# EAGLE design PCU (EAGLE 6.6.0)

## Sheet 1 of 3: Power Mesurment System
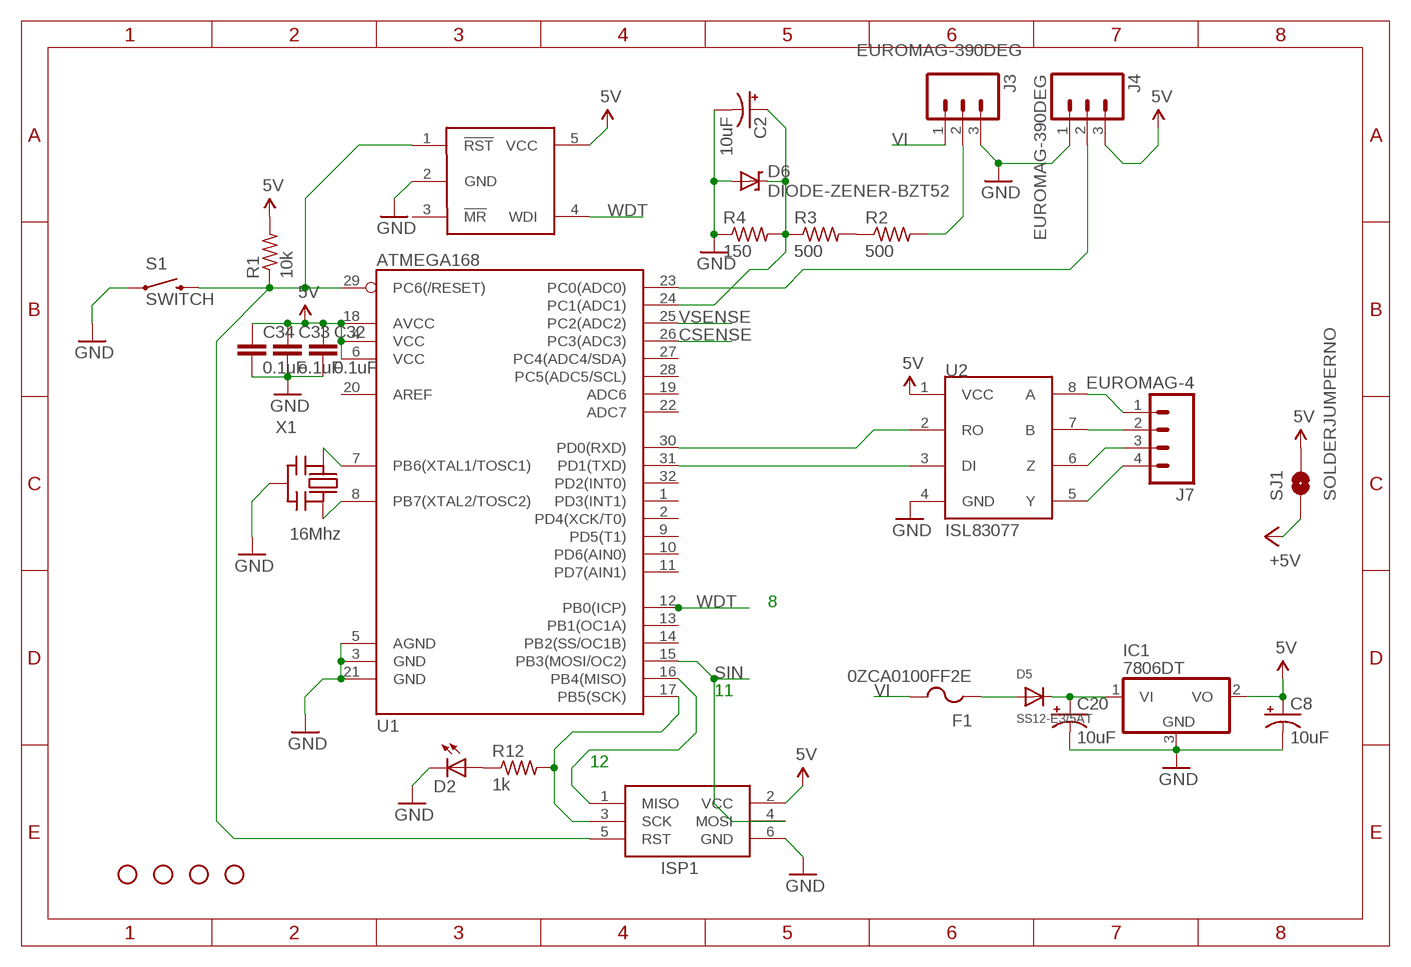
[diagram p0: schematic, sheet 1]

### Parts
C2  10uF  CAP_POL1206  [EIA3216]
C8  10uF  CPOL-USCT6032  [CT6032]
C20  10uF  CPOL-USCT6032  [CT6032]
C32  0.1uF  CAP0805  [0805]
C33  o.1uF  CAP0805  [0805]
C34  0.1uF  CAP0805  [0805]
D2  LEDCHIPLED_0805  [CHIPLED_0805]
D5  SS12-E3/5AT  DIODESMA  [SMADIODE]
D6  DIODE-ZENER-BZT52  [SOD-323]
F1  0ZCA0100FF2E  PTCFUSE-1206  [R1206]
IC1  7806DT  [TO252]
ISP1  AVRISP-6  [AVRISP]
J3  EUROMAG-390DEG  [M3]
J4  EUROMAG-390DEG  [M3]
J7  EUROMAG-4  [M4]
JP1  STAND-OFF  [STAND-OFF]
JP3  STAND-OFF  [STAND-OFF]
JP4  STAND-OFF  [STAND-OFF]
JP5  STAND-OFF  [STAND-OFF]
R1  10k  R-US_M0805  [M0805]
R2  500  R-US_M0805  [M0805]
R3  500  R-US_M0805  [M0805]
R4  150  R-US_M0805  [M0805]
R12  1k  R-US_M0805  [M0805]
S1  SWITCH  SWITCH-MOMENTARY-2PTH  [TACTILE-PTH]
SJ1  SOLDERJUMPERNO  [SJ_2S-NO]
U1  ATMEGA168  [TQFP32-08]
U2  ISL83077  [SO08]
U14  MAX823  [SOT23-5L]
X1  16Mhz  CERMOSCILL-AWCSR  [AWCSR]

### Nets
5V: C8.+ C32.1 C33.1 C34.1 IC1.2(VO) ISP1.2(VCC) J4.3 R1.2 SJ1.2 U1.4(VCC) U1.6(VCC) U1.18(AVCC) U2.1(VCC) U14.5(VCC) ; also sheet 2
+5V: SJ1.1 ; also sheet 2
CSENSE: U1.26(PC3(ADC3)) ; also sheet 2
GND: C2.C(-) C8.- C20.- C32.2 C33.2 C34.2 D2.C D6.2(A) IC1.3(GND) ISP1.6(GND) J3.3 J4.1 R4.1 S1.1 U1.3(GND) U1.5(AGND) U1.21(GND) U2.4(GND) U14.2(GND) X1.2(GND) ; also sheet 2,3
N$1: J7.1 U2.8(A)
N$2: J7.2 U2.7(B)
N$3: J7.3 U2.6(Z)
N$4: ISP1.5(RST) R1.1 S1.3 U1.29(PC6(/RESET)) U14.1(!RST)
N$5: U1.8(PB7(XTAL2/TOSC2)) X1.3(OUT)
N$7: ISP1.1(MISO) U1.16(PB4(MISO))
N$9: U1.7(PB6(XTAL1/TOSC1)) X1.1(IN)
N$11: J7.4 U2.5(Y)
N$12: U1.30(PD0(RXD)) U2.2(RO)
N$18: C20.+ D5.C IC1.1(VI)
N$19: D2.A R12.1
N$21: J3.2 R2.2
N$22: R2.1 R3.2
N$23: C2.A(+) D6.1(C) R3.1 R4.2 U1.24(PC1(ADC1))
N$24: J4.2 U1.23(PC0(ADC0))
N$29: D5.A F1.1
N$32: U1.31(PD1(TXD)) U2.3(DI)
SCLK: ISP1.3(SCK) R12.2 U1.17(PB5(SCK))
SIN: ISP1.4(MOSI) U1.15(PB3(MOSI/OC2))
VI: F1.2 J3.1
VSENSE: U1.25(PC2(ADC2)) ; also sheet 2
WDT: U1.12(PB0(ICP)) U14.4(WDI)
Unconnected: U1.1(PD3(INT1)) U1.2(PD4(XCK/T0)) U1.9(PD5(T1)) U1.10(PD6(AIN0)) U1.11(PD7(AIN1)) U1.13(PB1(OC1A)) U1.14(PB2(SS/OC1B)) U1.19(ADC6) U1.20(AREF) U1.22(ADC7) U1.27(PC4(ADC4/SDA)) U1.28(PC5(ADC5/SCL)) U1.32(PD2(INT0)) U14.3(!MR)

### Notes on the sheet
- 8
- 11
- 12

## Sheet 2 of 3: Power Control System (PCS)
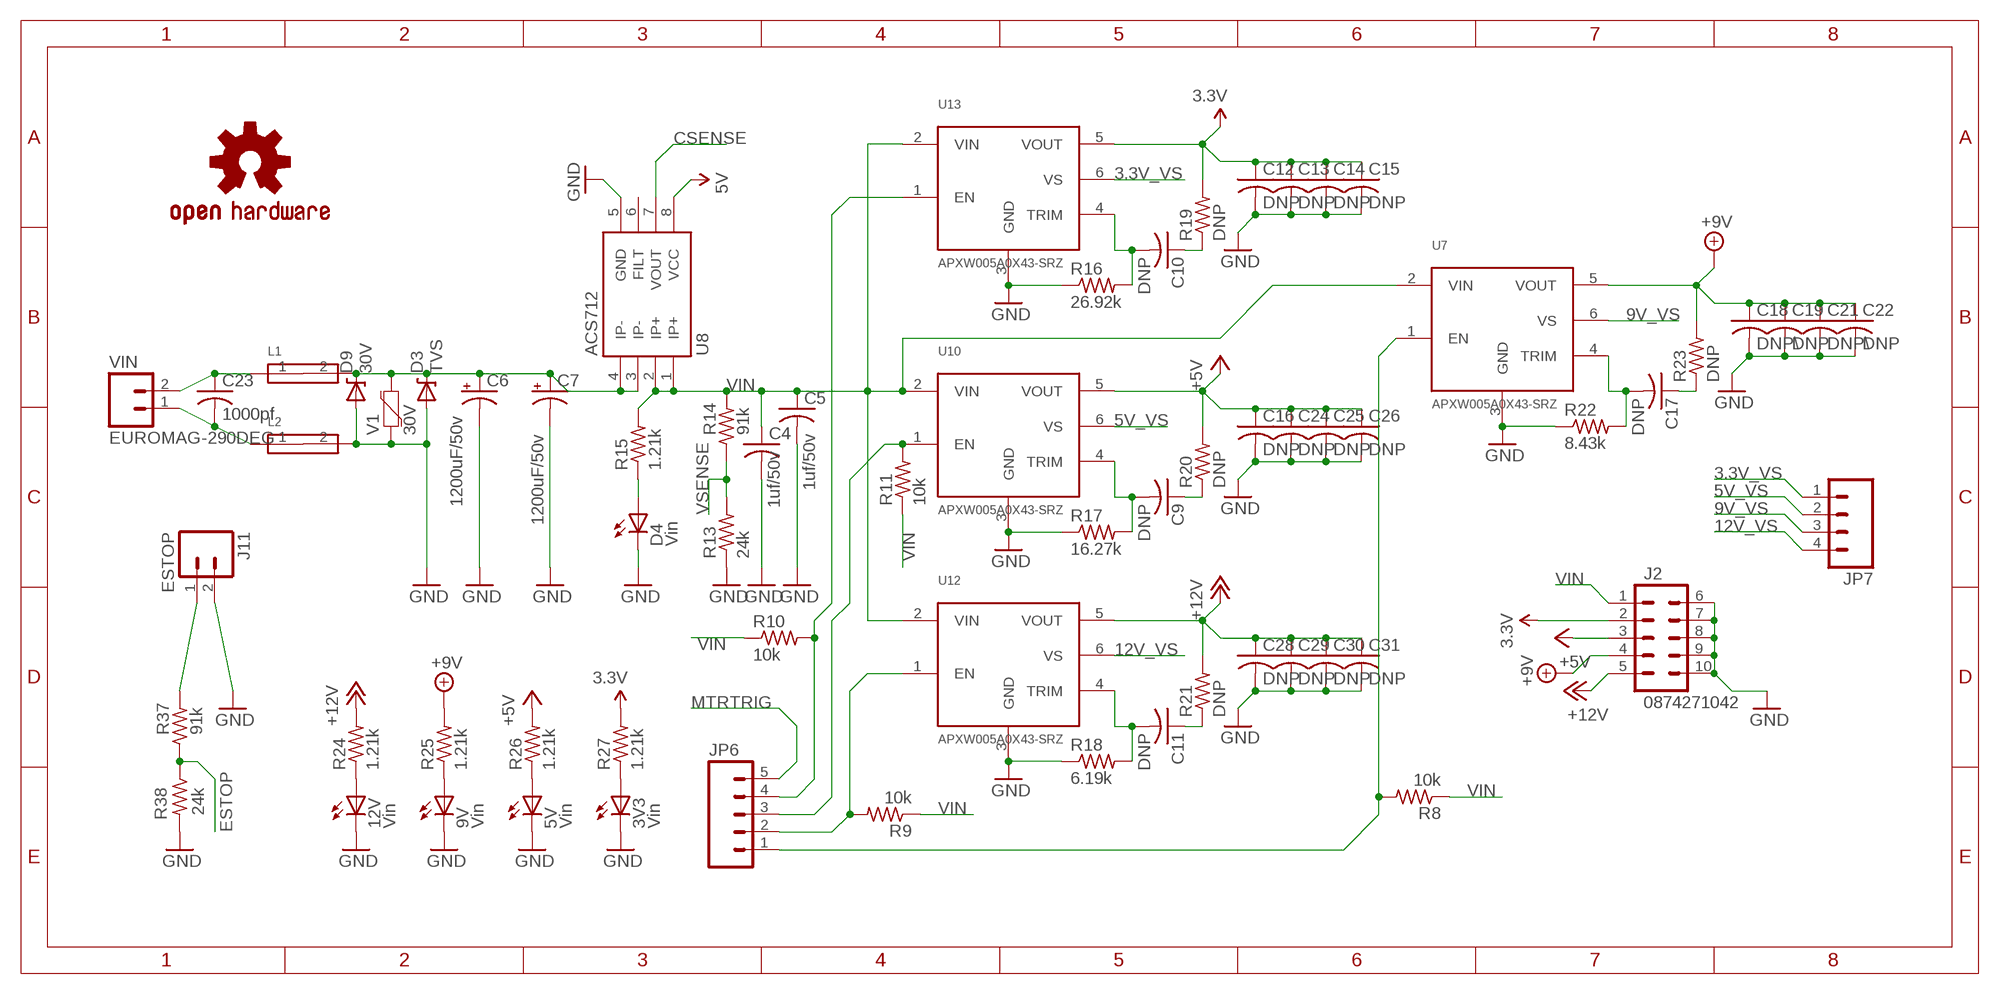
[diagram p1: schematic, sheet 2]

### Parts
3V3  Vin  LEDCHIP-LED0805  [CHIP-LED0805]
5V  Vin  LEDCHIP-LED0805  [CHIP-LED0805]
9V  Vin  LEDCHIP-LED0805  [CHIP-LED0805]
12V  Vin  LEDCHIP-LED0805  [CHIP-LED0805]
C4  1uf/50v  C-USC0805  [C0805]
C5  1uf/50v  C-USC0805  [C0805]
C6  1200uF/50v  CAP_CAN1  [CAN_18MM]
C7  1200uF/50v  CAP_CAN1  [CAN_18MM]
C9  DNP  C-USC0805  [C0805]
C10  DNP  C-USC0805  [C0805]
C11  DNP  C-USC0805  [C0805]
C12  DNP  C-USC0805  [C0805]
C13  DNP  C-USC0805  [C0805]
C14  DNP  C-USC0805  [C0805]
C15  DNP  C-USC0805  [C0805]
C16  DNP  C-USC0805  [C0805]
C17  DNP  C-USC0805  [C0805]
C18  DNP\  C-USC0805  [C0805]
C19  DNP  C-USC0805  [C0805]
C21  DNP\  C-USC0805  [C0805]
C22  DNP  C-USC0805  [C0805]
C23  1000pf  C-USC1825  [C1825]
C24  DNP  C-USC0805  [C0805]
C25  DNP  C-USC0805  [C0805]
C26  DNP  C-USC0805  [C0805]
C28  DNP  C-USC0805  [C0805]
C29  DNP  C-USC0805  [C0805]
C30  DNP  C-USC0805  [C0805]
C31  DNP  C-USC0805  [C0805]
D3  TVS  [DO-214AC]
D4  Vin  LEDCHIP-LED0805  [CHIP-LED0805]
D9  30V  DIODE-ZENERSMB  [SMB-DIODE]
J2  0874271042  [0874271042]
J11  ESTOP  EUROMAG-290DEG  [M2]
JP6  M05PTH_LONGPADS  [1X05_LONGPADS]
JP7  M04POLAR  [MOLEX-1X4]
L1  FERITEBEAD  [0603]
L2  FERITEBEAD  [0603]
R8  10k  R-US_R0805  [R0805]
R9  10k  R-US_R0805  [R0805]
R10  10k  R-US_R0805  [R0805]
R11  10k  R-US_R0805  [R0805]
R13  24k  R-US_R0805  [R0805]
R14  91k  R-US_R0805  [R0805]
R15  1.21k  R-US_R0805  [R0805]
R16  26.92k  R-US_R0805  [R0805]
R17  16.27k  R-US_R0805  [R0805]
R18  6.19k  R-US_R0805  [R0805]
R19  DNP  R-US_R0805  [R0805]
R20  DNP  R-US_R0805  [R0805]
R21  DNP  R-US_R0805  [R0805]
R22  8.43k  R-US_R0805  [R0805]
R23  DNP  R-US_R0805  [R0805]
R24  1.21k  R-US_R0805  [R0805]
R25  1.21k  R-US_R0805  [R0805]
R26  1.21k  R-US_R0805  [R0805]
R27  1.21k  R-US_R0805  [R0805]
R37  91k  R-US_R0805  [R0805]
R38  24k  R-US_R0805  [R0805]
U7  APXW005A0X43-SRZ  [APXW005A0X43-SRZ]
U8  ACS712  [SO08]
U10  APXW005A0X43-SRZ  [APXW005A0X43-SRZ]
U12  APXW005A0X43-SRZ  [APXW005A0X43-SRZ]
U13  APXW005A0X43-SRZ  [APXW005A0X43-SRZ]
U$8  OSHW-LOGOM  [OSHW-LOGO-M]
V1  30V  VARISTOR-0603  [0603-RES]
VIN  EUROMAG-290DEG  [M2]

### Nets
3.3V: C12.1 C13.1 C14.1 C15.1 J2.2 R19.2 R27.2 U13.5(VOUT)
3.3V_VS: JP7.1 U13.6(VS)
5V: U8.8(VCC) ; also sheet 1
5V_VS: JP7.2 U10.6(VS)
9V_VS: JP7.3 U7.6(VS)
12V_VS: JP7.4 U12.6(VS)
+5V: C16.1 C24.1 C25.1 C26.1 J2.3 R20.2 R26.2 U10.5(VOUT) ; also sheet 1
+9V: C18.1 C19.1 C21.1 C22.1 J2.4 R23.2 R25.2 U7.5(VOUT)
+12V: C28.1 C29.1 C30.1 C31.1 J2.5 R21.2 R24.2 U12.5(VOUT)
CSENSE: U8.7(VOUT) ; also sheet 1
ESTOP: R37.1 R38.1
GND: 3V3.C 5V.C 9V.C 12V.C C4.2 C5.2 C6.- C7.- C12.2 C13.2 C14.2 C15.2 C16.2 C18.2 C19.2 C21.2 C22.2 C24.2 C25.2 C26.2 C28.2 C29.2 C30.2 C31.2 D3.A D4.C D9.A J2.6 J2.7 J2.8 J2.9 J2.10 J11.2 L2.2 R13.1 R16.1 R17.1 R18.1 R22.1 R38.2 U7.3(GND) U8.5(GND) U10.3(GND) U12.3(GND) U13.3(GND) V1.1 ; also sheet 1,3
MTRTRIG: JP6.5 ; also sheet 3
N$6: 12V.A R24.1
N$8: 9V.A R25.1
N$10: JP6.4 R10.2 U13.1(EN)
N$13: 5V.A R26.1
N$14: 3V3.A R27.1
N$15: JP6.3 R11.2 U10.1(EN)
N$16: JP6.2 R9.2 U12.1(EN)
N$17: JP6.1 R8.2 U7.1(EN)
N$31: C23.2 L2.1 VIN.1
N$40: J11.1 R37.2
N$41: C6.+ C7.+ D3.C D9.C L1.2 U8.3(IP-) U8.4(IP-) V1.2
N$42: D4.A R15.1
N$43: C9.2 R17.2 U10.4(TRIM)
N$44: C10.2 R16.2 U13.4(TRIM)
N$45: C11.2 R18.2 U12.4(TRIM)
N$46: C10.1 R19.1
N$47: C9.1 R20.1
N$48: C11.1 R21.1
N$49: C17.2 R22.2 U7.4(TRIM)
N$50: C17.1 R23.1
VIN [power]: C4.1 C5.1 J2.1 R8.1 R9.1 R10.1 R11.1 R14.2 R15.2 U7.2(VIN) U8.1(IP+) U8.2(IP+) U10.2(VIN) U12.2(VIN) U13.2(VIN)
VOL: C23.1 L1.1 VIN.2
VSENSE: R13.2 R14.1 ; also sheet 1
Unconnected: U8.6(FILT)

## Sheet 3 of 3: Vibrating motor control
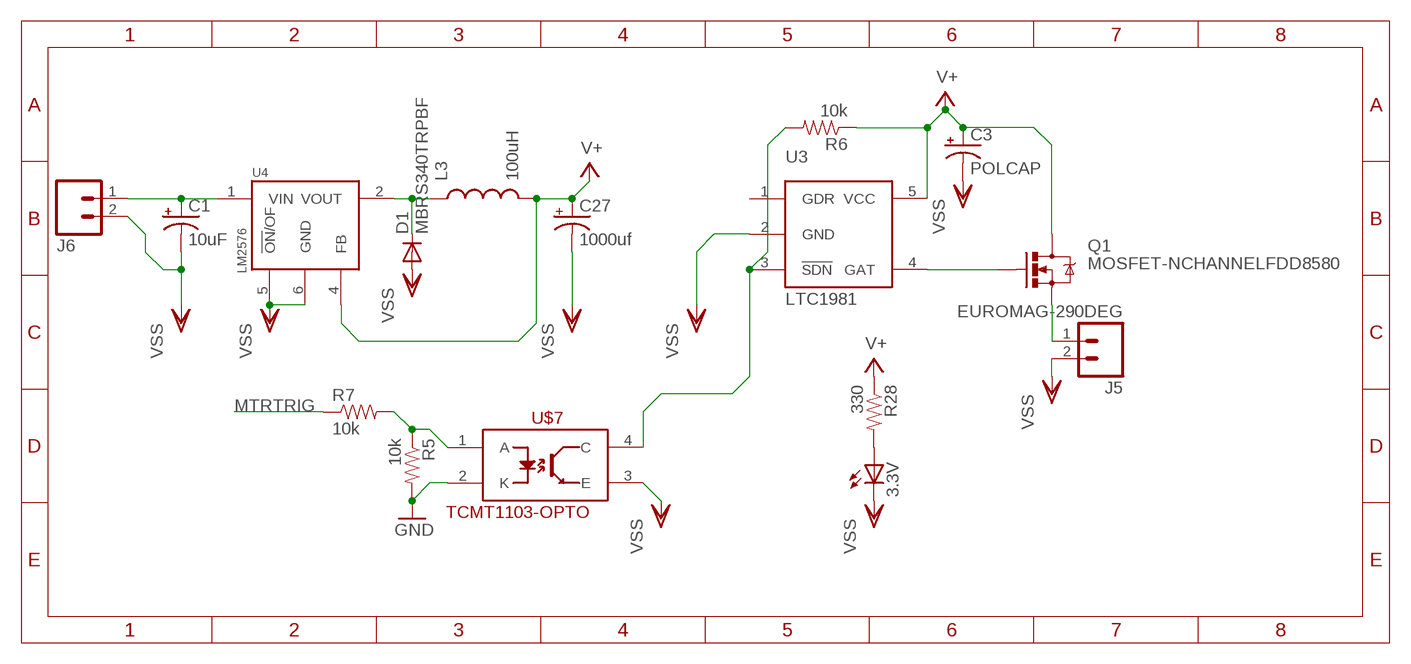
[diagram p2: schematic, sheet 3]

### Parts
3.3V  LEDCHIPLED_0805  [CHIPLED_0805]
C1  10uF  CAP_POL7343  [EIA7343]
C3  POLCAP  [POLC1206]
C27  1000uf  CAP_POLG  [PANASONIC_G]
D1  MBRS340TRPBF  DIODE-SMC  [SMC]
J5  EUROMAG-290DEG  [M2]
J6  EUROMAG-290DEG  [M2]
L3  100uH  INDUCTOR  [INDUCTOR_5X3]
Q1  MOSFET-NCHANNELFDD8580  [DPAK]
R5  10k  RESISTOR0805-RES  [0805]
R6  10k  RESISTOR0805-RES  [0805]
R7  10k  RESISTOR0805-RES  [0805]
R28  330  RESISTOR0805-RES  [0805]
U3  LTC1981  [SOT23-5L]
U4  LM2576  [TO-263-5]
U$7  TCMT1103-OPTO  [SSOP-4]

### Nets
GND: R5.2 U$7.2(K) ; also sheet 1,2
MTRTRIG: R7.1 ; also sheet 2
N$20: D1.C L3.1 U4.2(VOUT)
N$25: Q1.1(G) U3.4(GAT)
N$26: R6.2 U3.3(!SDN) U$7.4(C)
N$27: J5.1 Q1.3(S)
N$28: R5.1 R7.2 U$7.1(A)
N$30: 3.3V.A R28.2
V+: C3.1(+) C27.+ L3.2 Q1.4(D) R6.1 R28.1 U3.5(VCC) U4.4(FB)
VOLTIN: C1.A(+) J6.1 U4.1(VIN)
VSS: 3.3V.C C1.C(-) C3.2(-) C27.- D1.A J5.2 J6.2 U3.2(GND) U4.5(!ON!/OF) U4.6(GND) U$7.3(E)
Unconnected: U3.1(GDR)

## Library data of the parts
3.3V 3V3 5V 9V 12V D2 D4 = adafruit:LED: LED OSRAM: - CHIPLED LG R971, LG N971, LY N971, LG Q971, LY Q971, LO R971, LY R971 LH N974, LH R974 LS Q976, LO Q976, LY Q976 LO Q996 - Hyper CHIPLED LW Q18S LB Q993, LB Q99A, LB R99A - SideLED LS A670, LO A670, LY A670, LG A670, LP A670 LB A673, LV A673, LT A673, LW A673 LH A674 LY A675 LS A676, LA A676, LO A676, LY A676, LW A676 LS A679, LY A679, LG A679 - Hyper Micro SIDELED® LS Y876, LA Y876, LO Y876, LY Y876 LT Y87S - SmartLED LW L88C, LW L88S LB L89C, LB L89S, LG L890 LS L89K, LO L89K, LY L89K LS L896, LA L896, LO L896, LY L896 - TOPLED LS T670, LO T670, LY T670, LG T670, LP T670 LSG T670, LSP T670, LSY T670, LOP T670, LYG T670 LG T671, LOG T671, LSG T671 LB T673, LV T673, LT T673, LW T673 LH T674 LS T676, LA T676, LO T676, LY T676, LB T676, LH T676, LSB T676, LW T676 LB T67C, LV T67C, LT T67C, LS T67K, LO T67K, LY T67K, LW E67C LS E67B, LA E67B, LO E67B, LY E67B, LB E67C, LV E67C, LT E67C LW T67C LS T679, LY T679, LG T679 LS T770, LO T770, LY T770, LG T770, LP T770 LB T773, LV T773, LT T773, LW T773 LH T774 LS E675, LA E675, LY E675, LS T675 LS T776, LA T776, LO T776, LY T776, LB T776 LHGB T686 LT T68C, LB T68C - Hyper Mini TOPLED® LB M676 - Mini TOPLED Santana® LG M470 LS M47K, LO M47K, LY M47K Source: http://www.osram.convergy.de/
C1 C2 C27 = SparkFun:CAP_POL: Capacitor Polarized These are standard SMD and PTH capacitors. Normally 10uF, 47uF, and 100uF in electrolytic and tantalum varieties. Always verify the external diameter of the through hole cap, it varies with capacity, voltage, and manufacturer. The EIA devices should be standard.
C3 = NASA_LIB:POLCAP
C4 C5 C9-C19 C21-C26 C28-C31 = adafruit:C-US: CAPACITOR, American symbol
C6 C7 = NASA_LIB:CAP_CAN
C8 C20 = adafruit:CPOL-US: POLARIZED CAPACITOR, American symbol
C32-C34 = SparkFun:CAP: Capacitor Standard 0603 ceramic capacitor, and 0.1" leaded capacitor.
D1 = diode:DIODE-: DIODE
D3 = NASA_LIB:TVS
D5 = adafruit:DIODE: Diode SMADIODE - SMA Surface Mount Package 20V 1A Schottky Diode Digikey: 641-1014-6-ND DO-1N4148 - Through Hole Small Current Diode SOD-123 20V 1 A (.5mV Vf) Schottky Diode - Digikey: MBRX120TPMSCT-ND SOD-323 10V 570mA (.38mV Vf, 3ns) Schottky Diode - Digikey: ZLLS410CT-ND SOD-523 30V 30mA Schottky Diode (RB751S-40TE61) - Digikey: RB751S-40TE61CT-ND SOT23-R/W - SOT23 Package (R = Solder Paste/Reflow Ovens, W = Hand-Soldering) BAT54Film 40V 300mA - Digikey: 497-7162-1-ND
D6 D9 = SparkFun:DIODE-ZENER: Zener Diode Production Part - 8199 3.4V Zener Voltage
F1 = adafruit:PTCFUSE: PTC fuses, resettable thermistors
IC1 = adafruit:78*: Positive VOLTAGE REGULATOR Added bigger pads to the TO-92 package
ISP1 = adafruit:AVRISP: AVR ISP HEADER Standard 6 pin header for AVR programming
J2 = NASA_LIB:0874271042
J3 J4 = NASA_LIB:EUROMAG-3
J5 J6 J11 VIN = NASA_LIB:EUROMAG-2
J7 = NASA_LIB:EUROMAG-4
JP1 JP3-JP5 = SparkFun:STAND-OFF: Stand Off This is the mechanical footprint for a #4 phillips button head screw. Use the keepout ring to avoid running the screw head into surrounding components. SKU : PRT-00447
JP6 = SparkFun:M05: Header 5 Standard 5-pin 0.1" header. Use with straight break away headers (SKU : PRT-00116), right angle break away headers (PRT-00553), swiss pins (PRT-00743), machine pins (PRT-00117), and female headers (PRT-00115). Molex polarized connector foot print use with SKU : PRT-08230 with associated crimp pins and housings.
JP7 = SparkFun:M04: Header 4 Standard 4-pin 0.1" header. Use with straight break away headers (SKU : PRT-00116), right angle break away headers (PRT-00553), swiss pins (PRT-00743), machine pins (PRT-00117), and female headers (PRT-00115). Molex polarized connector foot print use with SKU : PRT-08231 with associated crimp pins and housings. 1MM SMD Version SKU: PRT-10208
L1 L2 = EmEndev:FERITEBEAD
L3 = NASA_LIB:INDUCTOR
Q1 = SparkFun:MOSFET-NCHANNEL
R1-R4 R8-R27 R37 R38 = adafruit:R-US_: RESISTOR, American symbol
R5-R7 R28 = SparkFun:RESISTOR: Resistor Basic schematic elements and footprints for 0603, 1206, and PTH resistors.
S1 = SparkFun:SWITCH-MOMENTARY-2
SJ1 = SparkFun:SOLDERJUMPER: Solder Jumper Standard SMD solder jumper. Used to automate production. Two varients : Normally Open and Normally Closed are the same, but have different paste layers. NC will have a large amount of paste and should jumper during reflow.
U1 = SparkFun:ATMEGA168
U2 = NASA_LIB:ISL83077
U3 = NASA_LIB:LTC1981
U4 = NASA_LIB:LM2576
U7 U10 U12 U13 = NASA_LIB:APXW005A0X43-SRZ
U8 = SparkFun:ACS712
U14 = NASA_LIB:MAX823
U$7 = SparkFun:TCMT1103-OPTO
U$8 = SparkFun:OSHW-LOGO: Open Source Hardware Logo This logo indicates the piece of hardware it is found on incorporates a OSHW license and/or adheres to the definition of open source hardware found here: http://freedomdefined.org/OSHW
V1 = SparkFun:VARISTOR: Varistor Varistor (Variable resistor) is a nonlinear resistive element of the voltage dependence that resistance changes with applied voltage. Varistor is equivalent with Zener diode of two series connection.
X1 = adafruit:CERMOSCILL: Ceramic oscillator with built in capacitors such as ZTT-12MHz http://www.ladyada.net/library/eagle

## Net classes
1 power: width 0.61 mm, drill 0.711 mm, clearance 0.203 mm

## Board
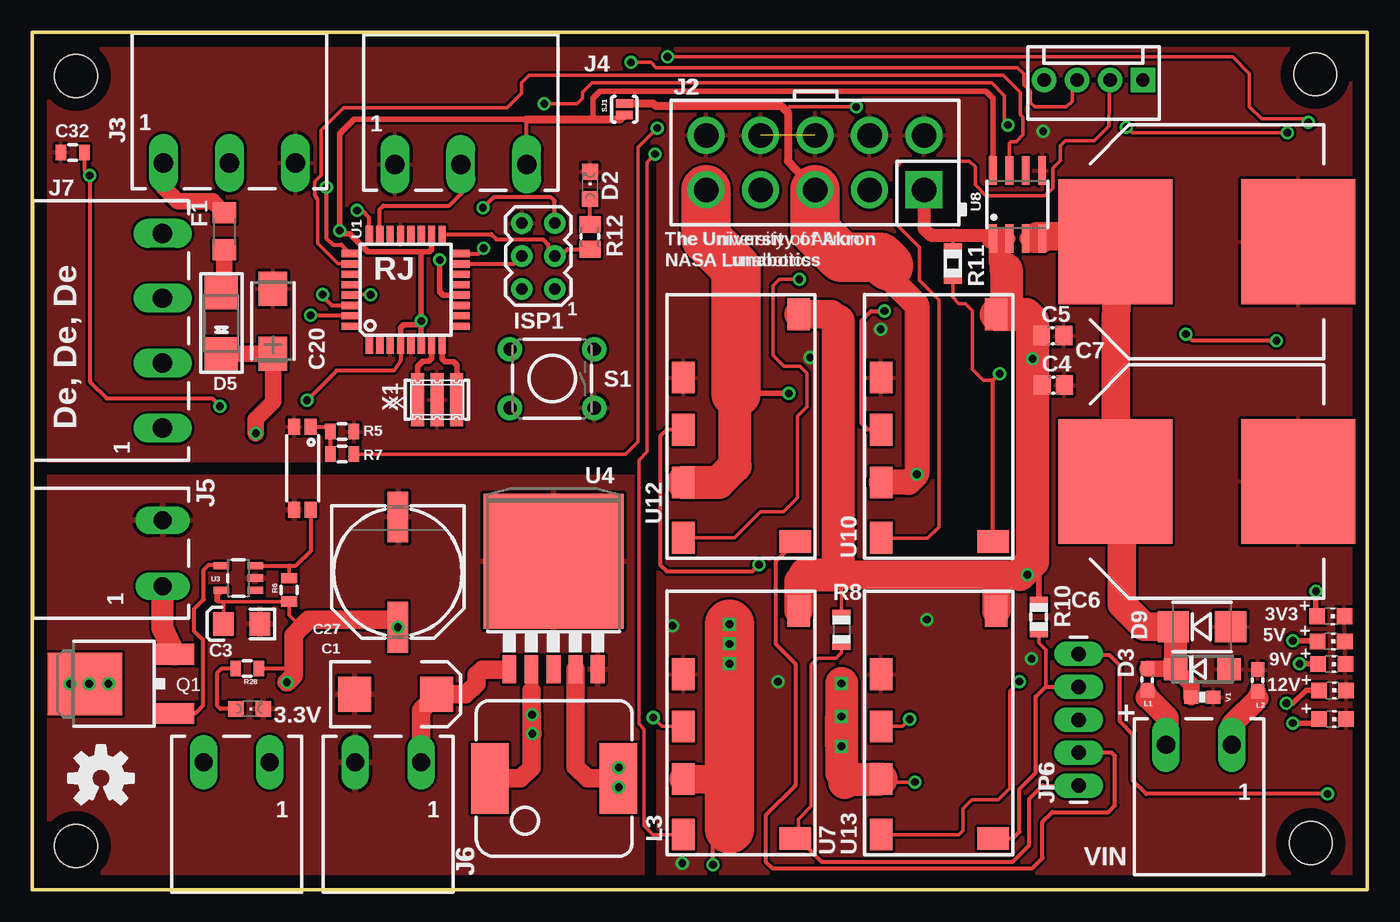
[diagram p3: board, top side]
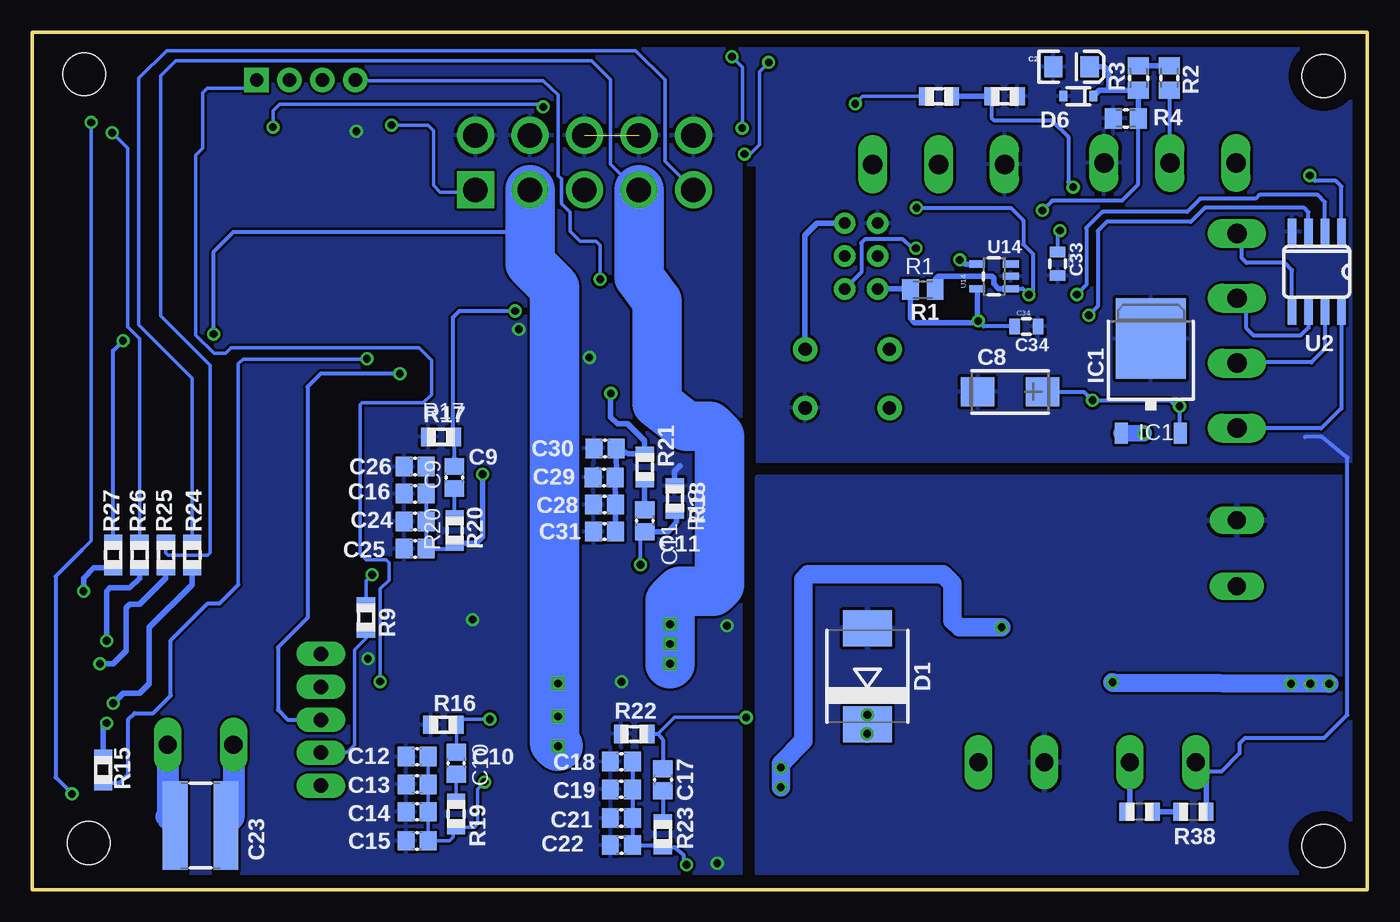
[diagram p4: board, bottom side, seen from below]

Size 102.87 x 66.04 mm. Coordinates in mm from the lower left corner, seen from the top.
Outline: 0,0 102.87,0 102.87,66.04 0,66.04 0,0
Copper layers (1*16): Top 0.035mm / dielectric 1.5mm / Bottom 0.035mm
Design rules "default": minimum track width 10mil, minimum drill 24mil, track to track 8mil, track to pad 8mil, pad to pad 8mil, via to via 8mil, smd to smd 8mil, copper to edge 40mil, drill to drill 8mil, minimum pad ring 10mil, minimum via ring 8mil, stop-mask expansion 4mil, vias tented up to drill 0mil, thermal gap 10mil

### Footprints (pad centres in the part's own frame; a part is rotated, then mirrored left to right if it is on the bottom)
CHIPLED_0805 = smd 1.2 x 1.2: A 0,-1.05; C 0,1.05
CHIP-LED0805 = smd 1.2 x 1.2: A 0,-1.05; C 0,1.05
EIA7343 = smd 2.55 x 2.7: A 3.17,0; C -3.17,0
EIA3216 = smd 1.4 x 1.6: A 1.4,0; C -1.4,0
POLC1206 = smd 1.6 x 1.8: 1 -1.4,0; 2 1.4,0
C0805 = smd 1.3 x 1.5: 1 -0.85,0; 2 0.85,0
CAN_18MM = smd 8.8 x 9.6: + 7.05,0; - -7.05,0
CT6032 = smd 2.6 x 2.2: + 2.5,0; - -2.5,0
C1825 = smd 1.9 x 6.8: 1 -1.95,0; 2 1.95,0
PANASONIC_G = smd 3.9 x 1.6: + 4.25,0; - -4.25,0
0805 = smd 0.8 x 1.2: 1 -0.9,0; 2 0.9,0
SMC = smd 2.8 x 3.8: A 3.7,0; C -3.7,0
DO-214AC = smd 1.8 x 1.7: A 2.05,0; C -2.05,0
SMADIODE = smd 2.54 x 2.54: A 2.349,0; C -2.349,0
SOD-323 = smd 0.63 x 0.83: 1 -1.15,0; 2 1.15,0
SMB-DIODE = smd 2.4 x 2.4: A 2.2,0; C -2.2,0
R1206 = smd 1.6 x 1.803: 1 -1.422,0; 2 1.422,0
TO252 = smd 1 x 1.6: 1 -2.28,-4.8; 2 2.28,-4.8 | smd 5.4 x 6.2: 3 0,2.5
AVRISP = drill 0.9 pad 1.626: 1 -1.27,2.54; 2 1.27,2.54; 3 -1.27,0; 4 1.27,0; 5 -1.27,-2.54; 6 1.27,-2.54
0874271042 = drill 1.9 square: 1 8.4,-2.1 | drill 1.9: 2 4.2,-2.1; 3 0,-2.1; 4 -4.2,-2.1; 5 -8.4,-2.1; 6 8.4,2.1; 7 4.2,2.1; 8 0,2.1; 9 -4.2,2.1; 10 -8.4,2.1
M3 = drill 1.5 long: 1 -5.08,0; 2 0,0; 3 5.08,0
M2 = drill 1.4 long: 1 -2.54,0; 2 2.54,0
M4 = drill 1.5 long: 1 0,0; 2 5,0; 3 10,0; 4 15,0
STAND-OFF = hole 3.302: 0,0
1X05_LONGPADS = drill 1.118 pad 1.88 long: 1 0,0; 2 2.54,0; 3 5.08,0; 4 7.62,0; 5 10.16,0
MOLEX-1X4 = drill 1.016 pad 1.88 square: 1 0,0 | drill 1.016 pad 1.88: 2 2.54,0; 3 5.08,0; 4 7.62,0
0603 = smd 1.1 x 1: 1 -0.85,0; 2 0.85,0
INDUCTOR_5X3 = smd 2.9 x 5.4: 1 -4.95,0; 2 4.95,0
DPAK = smd 1.6 x 3: 1 -2.28,-5.31; 3 2.28,-5.31 | smd 4.826 x 5.715: 4 0,1.588
M0805 = smd 1.3 x 1.6: 1 -0.95,0; 2 0.95,0
R0805 = smd 1.1 x 1.4: 1 -1,0; 2 1,0
TACTILE-PTH = drill 1.016 pad 1.88: 1 -3.251,2.261; 2 3.251,2.261; 3 -3.251,-2.261; 4 3.251,-2.261
SJ_2S-NO = smd 0.635 x 1.27: 1 -0.45,0; 2 0.45,0
TQFP32-08 = smd 1.27 x 0.559: 1 -4.293,2.8; 2 -4.293,2; 3 -4.293,1.2; 4 -4.293,0.4; 5 -4.293,-0.4; 6 -4.293,-1.2; 7 -4.293,-2; 8 -4.293,-2.8; 17 4.293,-2.8; 18 4.293,-2; 19 4.293,-1.2; 20 4.293,-0.4; 21 4.293,0.4; 22 4.293,1.2; 23 4.293,2; 24 4.293,2.8 | smd 0.559 x 1.27: 9 -2.8,-4.293; 10 -2,-4.293; 11 -1.2,-4.293; 12 -0.4,-4.293; 13 0.4,-4.293; 14 1.2,-4.293; 15 2,-4.293; 16 2.8,-4.293; 25 2.8,4.293; 26 2,4.293; 27 1.2,4.293; 28 0.4,4.293; 29 -0.4,4.293; 30 -1.2,4.293; 31 -2,4.293; 32 -2.8,4.293
SO08 = smd 0.66 x 2.032: 1 -1.905,-3.073; 2 -0.635,-3.073; 3 0.635,-3.073; 4 1.905,-3.073; 5 1.905,3.073; 6 0.635,3.073; 7 -0.635,3.073; 8 -1.905,3.073
SOT23-5L = smd 0.55 x 1.2: 1 -0.95,-1.3; 2 0,-1.3; 3 0.95,-1.3; 4 0.95,1.3; 5 -0.95,1.3
TO-263-5 = smd 1.067 x 2.159: 1 -3.404,-7.061; 2 -1.702,-7.061; 3 0,-7.061; 4 1.702,-7.061; 5 3.404,-7.061 | smd 10.8 x 10.41: 6 0,1.27
APXW005A0X43-SRZ = smd 1.73 x 2.44: 1 1.28,1.52 | smd 2.44 x 1.73: 2 18.796,1.27; 3 13.92,10.16; 4 9.906,10.16; 5 5.842,10.16; 6 1.574,10.16
SO08' = smd 0.61 x 2.21: 1 -1.905,-2.616; 2 -0.635,-2.616; 3 0.635,-2.616; 4 1.905,-2.616; 5 1.905,2.616; 6 0.635,2.616; 7 -0.635,2.616; 8 -1.905,2.616
SSOP-4 = smd 1.2 x 0.9: 1 -3.2,0.67; 2 -3.2,-0.6; 3 3.2,-0.6; 4 3.2,0.67
0603-RES = smd 1.1 x 1: 1 -0.85,0; 2 0.85,0
AWCSR = smd 1 x 4.1: 1 -1.5,0; 2 0,0; 3 1.5,0

### Placement (x,y rotation side)
3.3V  16.74,13.92 270 top
3V3  100.08,21.06 270 top
5V  100.1,19.13 270 top
9V  100.15,17.37 270 top
12V  100.2,15.34 270 top
C1  27.99,15.04 0 top
C2  22.78,63.4 0 bottom
C3  16.13,20.47 0 top
C4  78.69,38.86 0 top
C5  78.64,42.67 0 top
C6  90.53,31.45 180 top
C7  90.53,49.91 180 top
C8  27.51,38.35 0 bottom
C9  70.36,31.75 90 bottom
C10  70.21,9.73 90 bottom
C11  55.68,28.42 270 bottom
C12  73.23,10.24 180 bottom
C13  73.23,8.1 180 bottom
C14  73.23,5.99 180 bottom
C15  73.23,3.76 180 bottom
C16  73.38,30.51 180 bottom
C17  54.28,8.46 90 bottom
C18  57.48,9.86 180 bottom
C19  57.48,7.72 180 bottom
C20  18.54,43.79 270 top
C21  57.48,5.51 180 bottom
C22  57.48,3.43 180 bottom
C23  89.92,4.93 180 bottom
C24  73.38,28.37 180 bottom
C25  73.38,26.26 180 bottom
C26  73.38,32.59 180 bottom
C27  28.17,24.46 270 top
C28  58.78,29.67 180 bottom
C29  58.8,31.75 180 bottom
C30  58.72,33.99 180 bottom
C31  58.78,27.58 180 bottom
C32  3.1,56.79 180 top
C33  23.85,48.21 270 bottom
C34  26.26,43.38 0 bottom
D1  38.51,16.43 90 bottom
D2  42.98,54.25 0 top
D3  90.17,16.97 0 top
D4  100.2,13.13 270 top
D5  14.55,43.64 90 top
D6  22.25,61.14 180 bottom
D9  90.14,20.24 0 top
F1  14.78,50.72 90 top
IC1  16.66,39.95 0 bottom
ISP1  38.99,48.81 180 top
J2  60.33,56.01 0 top
J3  15.19,55.98 0 top
J4  33.02,55.88 0 top
J5  10.03,25.91 90 top
J6  27.41,9.8 180 top
J7  10.03,35.56 90 top
J11  15.75,9.8 180 top
JP1  98.88,62.81 0 top
JP3  3.35,3.35 0 top
JP4  3.35,62.69 0 top
JP5  98.53,3.58 0 top
JP6  80.64,8 90 top
JP7  85.6,62.38 180 top
L1  85.93,16.18 90 top
L2  94.44,16.1 90 top
L3  40.21,8.56 0 top
Q1  5.64,15.85 90 top
R1  34.24,46.23 180 bottom
R2  15.24,62.53 270 bottom
R3  17.63,62.53 90 bottom
R4  18.59,59.41 0 bottom
R5  23.88,35.28 0 top
R6  19.79,23.09 90 top
R7  23.88,33.55 180 top
R8  62.36,20.02 270 top
R9  77.17,20.95 270 bottom
R10  77.57,21.01 270 top
R11  70.94,48.23 270 top
R12  42.98,50.29 270 top
R13  27.94,61.11 180 bottom
R14  32.99,61.11 180 bottom
R15  97.41,9.22 270 bottom
R16  71.2,12.7 0 bottom
R17  71.37,34.87 0 bottom
R18  53.37,30.12 270 bottom
R19  70.21,5.82 270 bottom
R20  70.33,27.66 270 bottom
R21  55.68,32.56 90 bottom
R22  56.49,11.99 0 bottom
R23  54.28,4.27 270 bottom
R24  90.55,25.78 90 bottom
R25  92.58,25.78 90 bottom
R26  94.61,25.78 90 bottom
R27  96.65,25.78 90 bottom
R28  16.56,17.04 180 top
R37  17.53,5.99 180 bottom
R38  13.39,5.99 0 bottom
S1  40.06,39.37 180 top
SJ1  45.62,60.12 270 top
U1  28.77,46.21 90 top
U2  3.89,47.6 180 bottom
U3  15.88,24 90 top
U4  40.16,24.03 0 top
U7  60.33,2.67 90 top
U8  ACS712  [SO08']  75.92,52.78 0 top
U10  75.56,25.53 90 top
U12  60.33,25.53 90 top
U13  75.56,2.67 90 top
U14  28.75,47.24 90 bottom
U$7  20.78,32.46 270 top
U$8  5.28,8.59 0 top
V1  90.17,14.81 180 top
VIN  89.92,11.15 180 top
X1  31.19,37.73 0 top

### Tracks (layer width: path | path; a pad name or v marks a point on that pad's centre or on a via)
3.3V  (via drill 0.6)
  Top 0.254: v68.02,8.28 65.1,8.28 64.87,8.51
  Top 0.305: v95.89,42.29 89.41,42.29 v88.9,42.8
  Top 2.54: v62.36,11.05 v62.36,13.34 | v62.36,15.88 62.36,9.02 62.87,8.51 | 62.87,8.51 64.87,8.51 U13.5 | 62.61,8.26 62.87,8.51
  Bottom 0.254: C12.1 72.38,8.45 72.31,8.38 72.31,8.17 C13.1 C14.1 C15.1 70.71,3.76 70.43,4.04 70.43,4.59 R19.2 68.79,4.82 68.56,5.05 68.56,7.75 v68.02,8.28
  Bottom 0.305: R27.2 96.65,41.53 v95.89,42.29 | v88.9,42.8 88.9,49.15 87.38,50.67 65.15,50.67 64.9,50.93 64.9,51.32 64.53,51.69
  Bottom 0.406: R19.2
  Bottom 2.54: v62.36,13.34 v62.36,15.88
  Bottom 3.81: J2.2 64.53,51.69 64.53,48.27 62.61,46.35 62.61,11.3 v62.36,11.05
3.3V_VS  (via drill 0.6)
  Top 0.254: U13.6 71.4,4.24 71.7,4.55 71.7,6.22 72.42,6.93 74.45,6.93 75.34,7.82 75.34,15.29 v76.07,16.03
  Bottom 0.254: v76.07,16.03 76.07,23.16 75.39,23.85 75.39,25.17 75.62,25.4 77.14,25.4 77.6,25.86 77.6,37.36 77.47,37.49 72.75,37.49 72.11,38.12 72.11,40.77 73.08,41.73 87.55,41.73 87.96,41.33 88.88,41.33 90.27,42.72 90.27,56.59 89.74,57.12 89.74,61.39 89.38,61.75 86.23,61.75 JP7.1
5V  (via drill 0.6)
  Top 0.305: J4.3 38.1,59.31 38.08,59.33 | v14.45,37.24 13.84,37.85 5.71,37.85 4.42,39.14 v4.42,55.02 4,55.44 C32.1 | U1.4 28.37,40.74 27.84,39.98 23.44,39.98 v21.16,37.69
  Top 0.406: U8.8 74.02,60.98 73.48,61.52 43.74,61.52 43.2,60.98 43.2,59.33 | U1.18 30.77,49.34 30.58,49.15 30.15,49.15 | 30.15,49.15 25.83,49.15 24.46,50.52 23.93,50.52 v23.67,50.77 23.67,58.22 24.79,59.33 38.35,59.33 | U1.6 29.97,43.48 | 29.97,43.48 v29.97,43.81 29.97,48.97 30.15,49.15 | U1.4 28.37,43.28 28.6,43.51 29.95,43.51 29.97,43.48
  Top 0.61: 38.08,59.33 38.35,59.33 43.2,59.33 45.28,59.33 SJ1.2
  Bottom 0.305: U2.1 1.98,54.18 2.41,54.61 4.01,54.61 v4.42,55.02 | v14.45,37.24 14.45,36.93 | 14.45,36.93 14.45,35.22 IC1.2 | 14.45,36.93 15.21,37.69 v21.16,37.69 21.82,38.35 C8.+ | C34.1 29.54,43.38 v29.97,43.81 | C33.1 23.85,50.6 v23.67,50.77
  Bottom 0.406: ISP1.2 35.24,46.27 R1.2 35.19,44.01 34.87,43.69 30.1,43.69 v29.97,43.81 30.05,43.9 U14.5
5V_VS
  Top 0.254: JP7.2 82.98,58.8 81.86,57.68 79.63,57.68 79.25,57.3 79.25,56.16 78.64,55.58 78.64,54.05 78.05,53.47 73.51,53.47 72.67,54.3 72.67,55.68 72.24,56.11 67.03,56.11 66.62,55.7 66.62,51.23 68.35,49.51 68.35,46.94 69.85,45.44 69.85,27.91 68.99,27.05 65.45,27.05 U10.6
9V_VS  (via drill 0.6)
  Top 0.254: U7.6 47.83,4.24 47.14,4.93 47.14,12.37 46.74,12.78 46.74,33.1 47.37,33.73 47.37,56.06 v47.98,56.67 | v46.13,63.73 47.68,63.73 48.08,63.32 75.92,63.32 76.4,62.84 76.4,62.03 76.94,61.49 76.94,60.63 77.27,60.3 79.7,60.3 80.14,60.73 80.14,62 JP7.3
  Bottom 0.254: v47.98,56.67 47.57,56.67 46.84,57.4 46.84,63.02 v46.13,63.73
12V_VS  (via drill 0.6)
  Top 0.254: U12.6 54.13,27.1 56.13,29.11 57.89,29.11 58.98,30.2 58.98,36.47 59.69,37.19 59.69,39.78 59.16,40.31 57.94,40.31 57.07,41.17 57.07,46.51 57.58,47.02 v59.11,47.02 59.21,46.91
  Bottom 0.254: v59.11,47.02 59.13,49.25 59.13,49.66 59.44,49.96 60.68,49.96 61.44,50.72 61.44,52.2 62.1,52.86 62.1,54.76 62.36,55.02 62.36,61.24 63.5,62.33 77.93,62.33 JP7.4
+5V  (via drill 0.6)
  Top 0.254: v96.72,58.32 84.76,58.32 v84.33,58.75 | v63.5,60.3 58.37,60.3 58.08,60.01
  Top 0.61: SJ1.1 47.84,60.57 48.01,60.4 57.68,60.4 58.08,60.01 58.22,59.87 58.22,56.12 J2.3
  Top 1.93: 65.99,48.06 65.99,47.22 68.17,45.03 v68.17,32 67.54,31.37 U10.5
  Top 3.81: J2.3 60.33,50.75 62.36,48.72 65.33,48.72 65.99,48.06
  Bottom 0.254: R26.2 94.61,42.44 95.53,43.36 95.53,57.12 v96.72,58.32 | v84.33,58.75 84.33,59.99 83.82,60.5 63.7,60.5 v63.5,60.3
  Bottom 0.305: C26.1 C16.1 C24.1 C25.1 70.73,26.26 R20.2
  Bottom 0.406: v68.17,32 68.17,27.18 68.68,26.67 R20.2
+9V  (via drill 0.6)
  Top 0.305: v52.45,1.91 52.45,3.68 53.47,4.7
  Top 2.184: 53.72,4.7 53.47,4.7 52.96,4.7 53.26,4.24 | U7.5 53.47,8.51
  Top 3.81: v53.72,17.4 v53.72,18.92 | v53.72,20.45 53.72,8.26 | 53.72,8.26 53.72,4.7 | 53.47,8.51 53.72,8.26
  Bottom 0.254: R25.2 92.58,25.93 92.41,25.76 89.36,25.76 89.18,25.93 89.18,40.39 92.99,44.2 92.99,62.69 91.82,63.86 59.77,63.86 58.29,62.38 58.29,55.88 56.69,54.28 56.5,54.28 J2.4
  Bottom 0.305: C18.1 C19.1 C21.1 C22.1 54.65,3.43 R23.2 53.38,3.27 52.7,2.67 52.7,2.16 v52.45,1.91 | 55.62,50.93 56.12,51.44
  Bottom 3.81: J2.4 56.12,51.44 56.12,47.23 54.74,45.34 54.74,37.47 52.45,35.69 50.67,35.69 49.91,34.92 49.91,23.5 50.42,22.99 52.96,22.99 53.72,22.23 v53.72,20.45 v53.72,18.92 v53.72,17.4
+12V  (via drill 0.6)
  Top 0.406: v58.29,38.23 54.23,38.23
  Top 2.54: U12.5 52.88,31.37 54.15,32.64 54.15,39.17 53.65,39.67 53.65,41.1 54.23,41.68
  Top 3.81: J2.5 51.92,50.18 54.23,47.88 54.23,41.68 54.23,38.23
  Bottom 0.254: R24.2 90.55,39.4 94.67,43.51 94.67,62.51 92.53,64.64 56.39,64.64 54.13,62.38 54.13,56.11 J2.5
  Bottom 0.305: 52.2,53.98 51.99,53.98 J2.5
  Bottom 0.406: C31.1 C28.1 C29.1 57.85,31.6 C30.1 56.92,33.56 R21.2 55.68,34.57 57,35.89 57.78,35.89 58.29,36.4 v58.29,38.23
CSENSE
  Top 0.254: U1.26 23.55,48.21 21.97,49.78 21.97,53.14 21.77,53.52 21.77,54.53 22.25,55.04 22.25,58.5 24,60.25 36.6,60.25 37.69,61.34 37.69,62.15 38.28,62.74 74.85,62.74 76.15,61.44 76.15,59.69 76.35,59.49 76.35,58.14 75.84,57.63 75.41,57.63 75.29,57.51 U8.7
ESTOP
  Bottom 0.406: R37.1 R38.1
GND  (via drill 0.6)  (1 unrouted)
  Bottom 0.305: 4.78,34.87 3.5,34.87 1.52,33.27 1.52,13.46 3.3,11.68 9.4,11.68 9.83,11.25 9.83,10.49 11.23,9.09 12.5,9.09 12.57,9.17
  Bottom 0.406: R18.1 53.37,32.23 52.96,32.64 | C29.2 59.37,32.32 59.31,32.38 | R38.2 12.39,8.98 12.57,9.17 J11.2
  other vias: 77.01,17.78 57.45,16 50.09,2.03 49.33,20.32 68.94,20.8 59.94,41 65.38,43.18 77.9,58.42
  pour Top: 0,66.04 102.87,66.04 102.87,0 48.26,0 48.26,55.88 46.99,55.88 46.99,33.02 0,33.02
  pour Bottom: 0,66.04 102.87,66.04 102.87,0 48.26,0 48.26,55.88 46.99,55.88 46.99,33.02 0,33.02
MTRTRIG  (via drill 0.6)
  Top 0.254: R7.1 45.72,33.55 46.69,34.52 46.69,57.2 v48.16,58.67 | v48.95,64.16 92.51,64.16 93.8,62.87 93.8,60.33 94.74,59.38 98.07,59.38 v98.35,59.11
  Top 0.305: v99.82,7.37 85.85,7.37 84.84,8.38 84.84,11.94 83.82,12.95 83.82,17.27 83.06,18.03 80.77,18.03 JP6.5
  Bottom 0.254: v48.16,58.67 48.16,63.37 v48.95,64.16 | v98.35,59.11 98.35,26.87 99.06,26.16
  Bottom 0.305: 99.06,26.16 101.09,24.13 101.09,8.64 v99.82,7.37
N$1
  Bottom 0.305: U2.8 1.98,37.08 3.53,35.53 10.01,35.53 J7.1
N$2
  Bottom 0.305: U2.7 3.25,41.66 4.29,40.62 9.98,40.62 J7.2
N$3
  Bottom 0.305: U2.6 4.52,43.28 5.13,42.67 8.74,42.67 9.3,43.23 9.3,44.82 J7.3
N$4  (via drill 0.6)
  Top 0.305: ISP1.5 40.26,53.06 39.98,53.34 35.53,53.34 v34.72,52.53 | v26.06,45.82 24.49,45.82 U1.29
  Bottom 0.305: v34.72,52.53 27.46,52.53 26.49,51.56 26.49,49.71 25.76,48.97 25.76,46.13 v26.06,45.82 26.53,46.29 U14.1
  Bottom 0.406: U14.1 28.41,46.29 28.78,46.66 28.78,47.12 28.91,47.24 33.05,47.24 33.27,47.02 33.27,46.25 R1.1 | S1.3 43.31,50.42 42.39,51.33 40.28,51.33 ISP1.5
N$5
  Top 0.406: U1.8 31.57,40.89 31.8,40.66 32.46,40.66 32.72,40.41 32.72,38.58 32.69,38.56 X1.3
N$6  (via drill 0.6)
  Top 0.406: v96.65,14.35 97.16,14.35 98.17,15.37 99.13,15.37 12V.A
  Bottom 0.406: R24.1 90.55,23.5 93.85,20.19 93.85,15.88 94.61,15.11 95.89,15.11 v96.65,14.35
N$7  (via drill 0.6)
  Top 0.305: U1.16 34.38,49.01 v34.77,49.4
  Bottom 0.305: v34.77,49.4 35.05,49.4 35.76,50.09 38.71,50.09 38.99,49.84 38.99,47.55 ISP1.1
N$8  (via drill 0.6)
  Top 0.406: v97.66,17.4 99.08,17.4 9V.A
  Bottom 0.406: R25.1 92.58,24 94.61,21.97 95.38,21.97 95.63,21.72 95.63,18.41 96.65,17.4 v97.66,17.4
N$9
  Top 0.406: X1.1 29.69,40.31 30.07,40.69 30.53,40.69 30.79,40.95 30.79,41.9 U1.7
N$10
  Top 0.254: R10.2 77.57,19.02 78.11,18.49 78.11,15.67 78.16,15.62
  Top 0.305: U13.1 75.58,3.95 76.07,4.45 76.07,7.75 77.34,9.02 77.34,14.86 78.11,15.62 78.16,15.62 JP6.4
N$11
  Bottom 0.305: U2.5 5.79,47.73 6.35,48.28 9.3,48.28 9.65,48.64 9.65,50.18 J7.4
N$12  (via drill 0.6)
  Top 0.305: v22.38,45.85 22.38,45.7 23.06,45.01 U1.30
  Bottom 0.305: U2.2 3.25,52.96 3.81,53.52 8.31,53.52 8.59,53.24 12.85,53.24 13.87,52.22 20.4,52.22 21.64,50.98 21.64,46.58 v22.38,45.85
N$13  (via drill 0.6)
  Top 0.406: v97.16,19.18 99,19.18 5V.A
  Bottom 0.406: R26.1 94.61,24 95.38,23.24 96.9,23.24 97.16,22.99 v97.16,19.18
N$14  (via drill 0.6)
  Top 0.406: v98.93,22.99 98.93,21.15 3V3.A
  Bottom 0.406: R27.1 98.16,24.78 98.93,24 v98.93,22.99
N$15  (via drill 0.6)
  Top 0.254: 74.05,39.25 74.04,39.24 73.3,39.24 72.44,40.11 72.44,44.6 71.91,45.14 71.42,45.14 70.94,45.62 R11.2
  Top 0.305: U10.1 74.05,39.25 v74.55,39.75
  Bottom 0.305: v74.55,39.75 80.64,39.75 81.66,38.73 81.66,20.95 83.95,18.67 83.95,13.84 83.19,13.08 JP6.3
N$16
  Top 0.305: U12.1 57.28,25.27 57.28,18.92 58.8,17.4 58.8,8 56.52,5.71 56.52,2.16 57.02,1.65 77.09,1.65 77.85,2.41 77.85,5.21 78.61,5.97 82.93,5.97 83.44,6.48 83.44,10.29 83.19,10.54 JP6.2
  Bottom 0.254: R9.2 77.17,19.36 78.03,18.49 78.03,11.15 78.61,10.57 80.62,10.57 JP6.2
N$17
  Top 0.254: R8.2 62.36,18.24 61.95,17.83 60.53,17.83 60.02,17.32 60.02,6.4 59.05,5.44 59.05,4.27 59,4.22 59,3.99 59.05,3.95
  Top 0.305: U7.1 59.05,3.95 60.83,2.16 75.56,2.16 76.83,3.43 76.83,6.99 77.85,8 JP6.1
N$18  (via drill 0.6)
  Top 1.27: D5.C C20.+ 18.54,37.57 17.2,36.22 17.2,35.18 v17.22,35.15
  Bottom 1.27: v17.22,35.15 IC1.1 | IC1.1
N$19
  Top 0.305: R12.1 D2.A
N$20  (via drill 0.6)
  Top 1.016: U4.2 38.46,15.32
  Top 1.422: 38.46,12.09 38.46,9.4 37.64,8.59 35.28,8.59 L3.1 | 38.46,15.32 38.46,12.09 | 38.46,12.09 v38.53,12.01 38.51,12.04 v38.51,13.46
  Bottom 1.422: D1.C 38.51,12.04 v38.53,12.01
N$21
  Bottom 0.305: J3.2 15.19,61.53 R2.2
N$22
  Bottom 0.406: R2.1 R3.2
N$23  (via drill 0.6)
  Top 0.305: v25.02,52.32 25.4,52.32 25.91,51.82 25.91,50.56 U1.24
  Bottom 0.305: v25.02,52.32 24.26,53.09 18.9,53.09 17.68,54.3 17.68,58.98
  Bottom 0.406: R4.2 17.68,59.38 17.68,58.98 17.63,59.03 R3.1 19.99,61.59 | 19.99,61.59 20.65,61.59 D6.1 | C2.A 20.24,63.4 19.91,63.07 19.91,61.66 19.99,61.59
N$24
  Top 0.305: U1.23 26.77,52.43 27.05,52.7 32.13,52.7 33.15,53.72 33.15,55.75 J4.2
N$25
  Top 0.305: Q1.1 12.58,13.6 13.13,14.15 13.13,19.25 12.45,19.94 12.45,21.59 13.21,22.35 13.21,24.64 13.59,25.02 14.51,25.02 U3.4
N$26
  Top 0.254: R6.2 19.79,24.93 19.81,24.95
  Top 0.305: U3.3 19.81,24.95 20.3,24.95 21.46,26.11 21.46,29.25 U$7.4
N$27
  Top 1.676: Q1.3 10.03,20.14 J5.1
N$28
  Top 0.305: U$7.1 22.59,35.66 R5.1 R7.2
N$29
  Top 1.27: F1.1 14.78,46.22 D5.A
N$30
  Top 0.305: 3.3V.A 14.48,13.92 14.25,14.15 14.25,16.71 14.58,17.04 R28.2
N$31
  Top 1.27: 94.44,14.71 L2.1
  Top 1.676: 94.44,14.71 92.61,12.88 92.56,12.83 92.46,12.72 VIN.1
  Bottom 1.676: C23.2 92.56,5.62 92.46,5.72 VIN.1
N$32  (via drill 0.6)
  Top 0.305: v21.44,44.25 24.44,44.25 U1.31
  Bottom 0.305: U2.3 4.52,52.2 4.85,52.53 12.5,52.53 13.59,51.44 20.07,51.44 20.75,50.75 20.75,44.93 v21.44,44.25
N$40
  Bottom 0.406: J11.1 18.29,6.23 R37.2
N$41
  Top 1.016: U8.3 77.29,50.16 77.32,50.19
  Top 1.27: V1.2 89.32,15.77 D3.C 88.06,17.03 L1.2
  Top 1.778: D3.C 88.12,20.07 D9.C
  Top 2.184: D9.C 85.7,20.24 83.97,21.97 83.97,31.38 C6.+ 83.53,48.78 83.77,49.05 83.77,50.29 83.72,50.34 83.72,50.33 | 83.72,50.33 C7.+ | 83.72,50.33 77.67,50.33 | 77.67,50.33 77.46,50.33 77.32,50.19 77.27,50.14 | U8.4 77.83,50.18 77.67,50.33
N$42  (via drill 0.6)
  Top 0.406: v97.16,12.83 98.9,12.83 D4.A
  Bottom 0.406: R15.1 97.41,12.57 v97.16,12.83
N$43  (via drill 0.6)
  Top 0.305: U10.4 64.39,35.43 63.88,35.94 63.88,43.81 64.64,44.58 v65.66,44.58
  Bottom 0.305: v65.66,44.58 69.98,44.58 70.48,44.07 70.48,34.98 R17.2 70.37,33.29 70.23,33.15 70.23,32.73 C9.2
N$44  (via drill 0.6)
  Top 0.254: U13.4 67.06,12.57 v67.61,13.13
  Bottom 0.254: v67.61,13.13 69.76,13.13 R16.2 70.2,10.59 C10.2
N$45  (via drill 0.6)
  Top 0.305: U12.4 48.9,35.43 48.39,34.92 48.39,25.02 48.9,24.51 55.5,24.51 v56.01,25.02
  Bottom 0.305: v56.01,25.02 56.01,27.47 55.75,27.73
  Bottom 0.406: 55.75,27.73 C11.2 53.83,27.57 53.21,28.32 53.21,28.97 R18.2
N$46
  Bottom 0.254: C10.1 R19.1
N$47
  Bottom 0.305: C9.1 70.36,28.69 R20.1
N$48
  Bottom 0.406: C11.1 R21.1
N$49  (via drill 0.6)
  Top 0.254: U7.4 48.54,12.57 v47.85,13.26
  Bottom 0.254: v47.85,13.26 53.39,13.26 54.66,11.99
  Bottom 0.305: R22.2 54.66,11.99 54.28,11.56 C17.2
N$50
  Bottom 0.305: C17.1 R23.1
SCLK
  Top 0.305: U1.17 35.35,50.5 35.76,50.09 39.34,50.09 39.75,49.68 39.75,49.32 ISP1.3 40.71,48.81 41.25,49.35 42.97,49.35 R12.2
SIN
  Top 0.305: U1.15 37.12,48.21 ISP1.4
V+  (via drill 0.6)  (1 unrouted)
  Top 0.254: 20.71,20.21 19.79,21.13 R6.1 14.78,22.19 | 14.78,22.19 14.31,22.19 14.22,22.28 | v4.37,15.85 4.72,15.85 4.75,15.88 4.95,15.88 | 4.95,15.88 5,15.88 | 5,15.88 | v5.87,15.85 4.99,15.85 4.95,15.88 | 5,15.88 5.1,15.88 5.11,15.88 | C3.1 14.73,22.14 14.78,22.19
  Top 0.305: R28.1 19.79,17.04 20.12,16.71
  Top 0.406: 14.22,22.28 14.22,22.7 U3.5
  Top 1.422: U4.4 41.86,9.47 42.77,8.56 44.81,8.56 | 44.81,8.56 L3.2 | v45.19,7.87 45.19,8.18 44.81,8.56 | C27.+ 28.17,20.78 21.29,20.78 20.71,20.21 20.12,19.61 20.12,16.71 20.12,16.46 v19.62,15.96 19.61,15.98 | 4.8,15.88 Q1.4 v2.92,15.85
  Bottom 1.422: v45.19,7.87 v45.19,9.4 45.19,9.7 43.43,11.46 43.43,23.93 43.08,24.28 32.69,24.28 31.95,23.55 31.95,20.73 31.42,20.19 28.19,20.19 C27.+ | v2.92,15.85 v19.61,15.95 v19.62,15.96
  other vias: 28.17,20.21
VI
  Top 1.27: J3.1 10.11,54.13 11.2,53.03 13.89,53.03 F1.2
VIN  (via drill 0.6)
  Top 0.254: 69.36,50.4 69.34,50.42 | v76.68,24.26 76.68,24.77 76.63,24.82 | R8.1 62.36,24.05 62,24.41 | R11.1 70.94,50.37 70.99,50.42 | v39.45,60.55 41.99,60.55 42.39,60.96 42.39,61.42 43.13,62.15 73.94,62.15 74.93,61.16 74.93,59.16 v75.18,58.9 | v77.09,40.89 77.09,40.97 76.61,41.45 | 75.06,47.88 75.06,47.78
  Top 0.305: 77.09,43.81 77.09,43.37 | C5.1 77.79,39.43 77.6,39.24 77.6,39.1 C4.1
  Top 0.406: 76.07,24.26 v76.68,24.26 77.57,24.26 R10.1
  Top 0.61: C5.1 77.39,42.67 77.09,42.98
  Top 1.016: J2.1 68.72,50.91 69.22,50.42 69.34,50.42 70.99,50.42 74.04,50.42 74.55,49.91 | 74.55,50.16 U8.2
  Top 1.676: U8.1 74.55,50.16 74.55,49.91 74.55,48.39 75.06,47.88
  Top 2.184: 76.07,24.26 74.3,24.26 | 74.3,24.26 59.56,24.26 59.05,23.75 U7.2 | U13.2 74.3,24.26 | U12.2 61.59,44.32 62.1,43.81
  Top 2.54: 75.06,47.78 75.06,45.09 U10.2 76.58,44.32 77.09,43.81 77.09,42.98 v77.09,40.89 77.09,25.27 76.63,24.82 76.07,24.26 | 62.1,43.81 62.1,24.51 62,24.41 61.85,24.26 59.56,24.26
  Bottom 0.254: R9.1 77.17,23.77 v76.68,24.26 | R14.2 38.89,61.11 v39.45,60.55 | v75.18,58.9 72.39,58.9 71.96,58.47 71.96,54.25 71.45,53.75 68.89,53.75 J2.1 | 87,23.5 87,40.51 86.64,40.87 77.11,40.87 v77.09,40.89
  Bottom 0.305: R15.2 96.15,8.22 95.48,8.89 95.48,13.11 95,13.59 93.55,13.59 92.2,14.94 92.2,19.2 89.36,22.05 88.44,22.05 87,23.5
VOL
  Top 1.27: 85.95,14.81 85.95,15.3 L1.1
  Top 1.676: 85.93,14.81 87.48,13.26 87.48,11.25 VIN.2
  Top 1.778: 85.93,14.81 85.95,14.81
  Bottom 1.676: 87.48,5.42 C23.1 87.38,5.52 VIN.2
VOLTIN
  Top 0.305: U4.1 36.25,16.97 36.22,16.94
  Top 1.422: J6.1 29.95,13.82 C1.A 33.4,15.04 34.24,15.88 34.24,16.54 34.65,16.94 36.22,16.94 36.47,16.94
VSENSE  (via drill 0.6)
  Top 0.305: v22.66,54.13 22.66,50.19 23.16,49.68 23.81,49.68 U1.25
  Bottom 0.305: R13.2 28.94,59.45 28.78,59.28 24.33,59.28 23.04,57.99 23.04,54.53 v22.66,54.13
  Bottom 0.406: R14.1 R13.2
VSS
  pour Bottom: 0,0 46.99,0 46.99,31.75 0,31.75
  pour Top: 0,0 46.99,0 47.02,31.75 0.03,31.75
WDT  (via drill 0.6)
  Top 0.406: v31.39,48.51 31.39,46.05 31.65,45.8 33.05,45.8 U1.12
  Bottom 0.406: U14.4 30.95,48.19 v31.39,48.51

### Text on the board
tPlace: The University of Akron | NASA Lunabotics | RJ
tNames: +
_tsilk: J4 | J2 | SJ1 | C32 | J3 | 1 | 1 | J7 | D2 | R12 | U8 | F1 | U1 | The University of Akron | R11 | NASA Lunabotics | RJ | 1 | ISP1 | C5 | C20 | C7 | C4 | S1 | D5 | X1 | De, De, De | R5 | 1 | R7 | J5 | U4 | U12 | U10 | U3 | R6 | R10 | C6 | 1 | R8 | + | 3V3 | C27 | + | C1 | D3 | D9 | 5V | + | C3 | 9V | + | R28 | Q1 | L1 | V1 | 12V | L2 | + | 3.3V | + | 1 | 1 | 1 | JP6 | U7 | L3 | U13 | VIN | J6
_bsilk: R2 | C2 | R3 | R4 | D6 | C33 | U14 | R1 | U2 | C34 | C8 | IC1 | R17 | C30 | R21 | C9 | C26 | C29 | R18 | C16 | C28 | R20 | C24 | C31 | R24 | R25 | R26 | R27 | C25 | C11 | R9 | D1 | R16 | R22 | C12 | R15 | C18 | C10 | C13 | C19 | C17 | R19 | C14 | R23 | C21 | C23 | C22 | C15 | R38